# Altium schematic sheet Interface.SchDoc
size A4
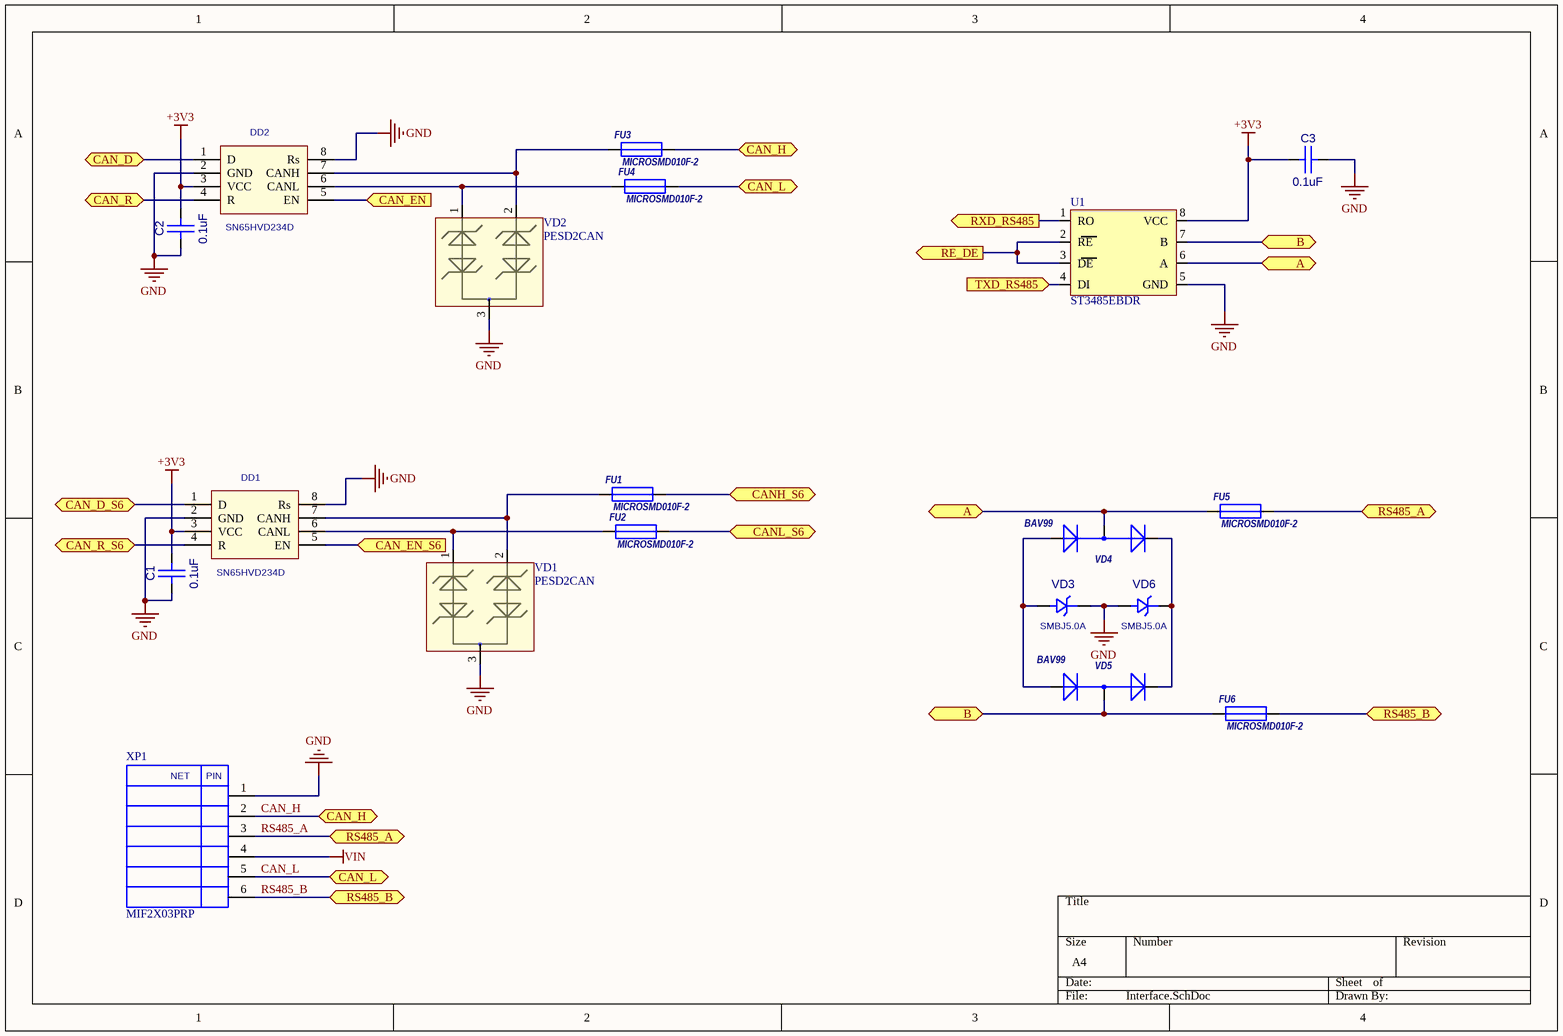
[diagram p0: Interface.SchDoc]

## Parts
C1  0.1uF  [CC0603-3M]
C2  0.1uF  [CC0603-3M]
C3  0.1uF  [CC0603-3M]
DD1  SN65HVD234D  [SO-8]
DD2  SN65HVD234D  [SO-8]
FU1  MICROSMD010F-2  [RC1210]
FU2  MICROSMD010F-2  [RC1210]
FU3  MICROSMD010F-2  [RC1210]
FU4  MICROSMD010F-2  [RC1210]
FU5  MICROSMD010F-2  [RC1210]
FU6  MICROSMD010F-2  [RC1210]
U1  ST3485EBDR  [SO-8]
VD1  PESD2CAN  [SOT-23(123)]
VD2  PESD2CAN  [SOT-23(123)]
VD3  SMBJ5.0A  [SMB]
VD4  BAV99  [SOT-23(GSD)]
VD5  BAV99  [SOT-23(GSD)]
VD6  SMBJ5.0A  [SMB]
XP1  MIF2X03PRP  [MIF2X03PRP]

## Ports
A (bidir), B (bidir), CAN_D, CAN_D_S6, CAN_EN (in), CAN_EN_S6 (in), CAN_H, CAN_L, CAN_R, CAN_R_S6, CANH_S6, CANL_S6, RE_DE (out), RS485_A, RS485_B, RXD_RS485 (out), TXD_RS485 (in)

## Nets
+3V3: C1.2(B) C2.2(B) C3.1(A) DD1.3(VCC) DD2.3(VCC) U1.8(VCC)
GND: C1.1(A) C2.1(A) C3.2(B) DD1.2(GND) DD1.8(Rs) DD2.2(GND) DD2.8(Rs) U1.5(GND) VD1.3 VD2.3 VD3.2(K) VD6.1(A) XP1.1
VIN: XP1.4
A: FU5.1 U1.6(A) VD4.3(AK) ; port A
B: FU6.1 U1.7(B) VD5.3(AK) ; port B
CAN_D: DD2.1(D) ; port CAN_D
CAN_D_S6: DD1.1(D) ; port CAN_D_S6
CAN_EN: DD2.5(EN) ; port CAN_EN
CAN_EN_S6: DD1.5(EN) ; port CAN_EN_S6
CAN_H: FU3.2 XP1.2 ; port CAN_H
CAN_L: FU4.2 XP1.5 ; port CAN_L
CAN_R: DD2.4(R) ; port CAN_R
CAN_R_S6: DD1.4(R) ; port CAN_R_S6
CANH_S6: FU1.2 ; port CANH_S6
CANL_S6: FU2.2 ; port CANL_S6
RE_DE: U1.2(RE) U1.3(DE) ; port RE_DE
RS485_A: FU5.2 XP1.3 ; port RS485_A
RS485_B: FU6.2 XP1.6 ; port RS485_B
RXD_RS485: U1.1(RO) ; port RXD_RS485
TXD_RS485: U1.4(DI) ; port TXD_RS485
NetDD1_6: DD1.6(CANL) FU2.1 VD1.1
NetDD1_7: DD1.7(CANH) FU1.1 VD1.2
NetDD2_6: DD2.6(CANL) FU4.1 VD2.1
NetDD2_7: DD2.7(CANH) FU3.1 VD2.2
NetVD3_1: VD3.1(A) VD4.1(A) VD5.1(A)
NetVD4_2: VD4.2(K) VD5.2(K) VD6.2(K)

## Notes on the sheet
- (in symbol MIF2X03PRP) NET; PIN

## Library data of the parts
C1-C3 = CC0603: Value: 0.1uF
DD1 DD2 = SN65HVD234D: CAN Transceiver; Value: *
FU1-FU6 = MICROSMD
  FU1-FU4: Value: MICROSMD010F-2
  FU5 FU6: Value: *
VD1 VD2 = PESD2CAN: TVS for CAN
VD3 VD6 = SMBJ: Value: SMBJ5.0A
VD4 VD5 = BAV99: 1.0 Ampere General Purpose Rectifier; ComponentField6: Published 8-Jun-2000, Modified 11-July-2000: SIM Model Added.; Value: *
U1 = ST3485EBDR: Value: ST3485EBDR
XP1 = MIF2X03PRP: Value: *